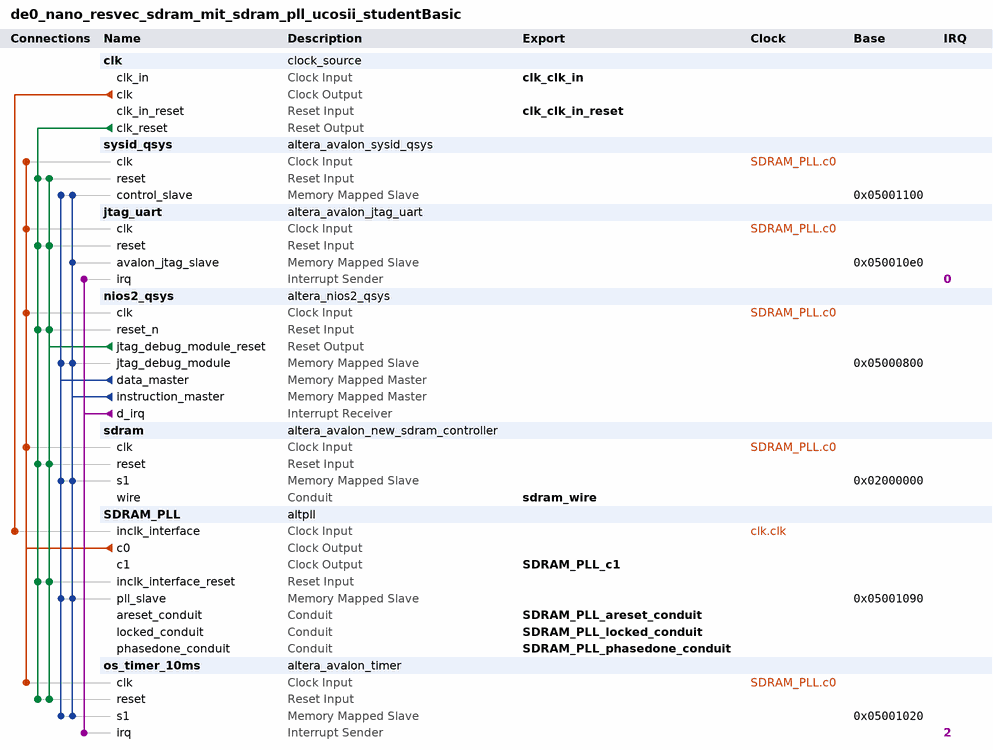
[diagram p0: system contents]
# Platform Designer (Qsys) system de0_nano_resvec_sdram_mit_sdram_pll_ucosii_studentBasic, Cyclone IV GX Unknown
# Parameters at their usual value, and those the tool derives, are not listed.
package require -exact qsys 13.0
create_system de0_nano_resvec_sdram_mit_sdram_pll_ucosii_studentBasic
set_project_property DEVICE_FAMILY {Cyclone IV GX}
set_project_property DEVICE Unknown

add_instance clk clock_source 13.0
set_instance_parameter_value clk clockFrequency 50000000

add_instance sysid_qsys altera_avalon_sysid_qsys 13.0
set_instance_parameter_value sysid_qsys id 20110728

add_instance jtag_uart altera_avalon_jtag_uart 13.0.1.99.2
set_instance_parameter_value jtag_uart simInteractiveOptions INTERACTIVE_ASCII_OUTPUT

add_instance nios2_qsys altera_nios2_qsys 13.0
set_instance_parameter_value nios2_qsys manuallyAssignCpuID false
set_instance_parameter_value nios2_qsys resetSlave sdram.s1
set_instance_parameter_value nios2_qsys exceptionSlave sdram.s1
set_instance_parameter_value nios2_qsys breakSlave nios2_qsys.jtag_debug_module
set_instance_parameter_value nios2_qsys impl Tiny
set_instance_parameter_value nios2_qsys icache_size 4096

add_instance sdram altera_avalon_new_sdram_controller 13.0.1.99.2
set_instance_parameter_value sdram TAC 5.5
set_instance_parameter_value sdram TRCD 20.0
set_instance_parameter_value sdram TRP 20.0
set_instance_parameter_value sdram casLatency 3
set_instance_parameter_value sdram columnWidth 9
set_instance_parameter_value sdram dataWidth 16
set_instance_parameter_value sdram generateSimulationModel false
set_instance_parameter_value sdram model custom
set_instance_parameter_value sdram numberOfBanks 4
set_instance_parameter_value sdram numberOfChipSelects 1
set_instance_parameter_value sdram powerUpDelay 100.0
set_instance_parameter_value sdram refreshPeriod 15.625
set_instance_parameter_value sdram rowWidth 13

add_instance SDRAM_PLL altpll 13.0
set_instance_parameter_value SDRAM_PLL INCLK0_INPUT_FREQUENCY 20000
set_instance_parameter_value SDRAM_PLL CLK0_MULTIPLY_BY 1
set_instance_parameter_value SDRAM_PLL CLK1_MULTIPLY_BY 1
set_instance_parameter_value SDRAM_PLL CLK0_DIVIDE_BY 1
set_instance_parameter_value SDRAM_PLL CLK1_DIVIDE_BY 1
set_instance_parameter_value SDRAM_PLL CLK1_PHASE_SHIFT -1600
set_instance_parameter_value SDRAM_PLL CLK1_DUTY_CYCLE 50
set_instance_parameter_value SDRAM_PLL PORT_clk1 PORT_USED
set_instance_parameter_value SDRAM_PLL PORT_clk2 PORT_UNUSED
set_instance_parameter_value SDRAM_PLL PORT_clk3 PORT_UNUSED
set_instance_parameter_value SDRAM_PLL PORT_ARESET PORT_USED
set_instance_parameter_value SDRAM_PLL PORT_LOCKED PORT_USED

add_instance os_timer_10ms altera_avalon_timer 13.0.1.99.2
set_instance_parameter_value os_timer_10ms period 10
set_instance_parameter_value os_timer_10ms periodUnits MSEC

# connections
add_connection clk.clk SDRAM_PLL.inclk_interface clock
add_connection SDRAM_PLL.c0 jtag_uart.clk clock
add_connection SDRAM_PLL.c0 nios2_qsys.clk clock
add_connection SDRAM_PLL.c0 os_timer_10ms.clk clock
add_connection SDRAM_PLL.c0 sdram.clk clock
add_connection SDRAM_PLL.c0 sysid_qsys.clk clock
add_connection clk.clk_reset jtag_uart.reset reset
add_connection clk.clk_reset nios2_qsys.reset_n reset
add_connection clk.clk_reset os_timer_10ms.reset reset
add_connection clk.clk_reset sdram.reset reset
add_connection clk.clk_reset SDRAM_PLL.inclk_interface_reset reset
add_connection clk.clk_reset sysid_qsys.reset reset
add_connection nios2_qsys.jtag_debug_module_reset jtag_uart.reset reset
add_connection nios2_qsys.jtag_debug_module_reset nios2_qsys.reset_n reset
add_connection nios2_qsys.jtag_debug_module_reset os_timer_10ms.reset reset
add_connection nios2_qsys.jtag_debug_module_reset sdram.reset reset
add_connection nios2_qsys.jtag_debug_module_reset SDRAM_PLL.inclk_interface_reset reset
add_connection nios2_qsys.jtag_debug_module_reset sysid_qsys.reset reset
add_connection nios2_qsys.data_master nios2_qsys.jtag_debug_module avalon
set_connection_parameter_value nios2_qsys.data_master/nios2_qsys.jtag_debug_module baseAddress 0x05000800
add_connection nios2_qsys.data_master os_timer_10ms.s1 avalon
set_connection_parameter_value nios2_qsys.data_master/os_timer_10ms.s1 baseAddress 0x05001020
add_connection nios2_qsys.data_master sdram.s1 avalon
set_connection_parameter_value nios2_qsys.data_master/sdram.s1 baseAddress 0x02000000
add_connection nios2_qsys.data_master SDRAM_PLL.pll_slave avalon
set_connection_parameter_value nios2_qsys.data_master/SDRAM_PLL.pll_slave baseAddress 0x05001090
add_connection nios2_qsys.data_master sysid_qsys.control_slave avalon
set_connection_parameter_value nios2_qsys.data_master/sysid_qsys.control_slave baseAddress 0x05001100
add_connection nios2_qsys.instruction_master jtag_uart.avalon_jtag_slave avalon
set_connection_parameter_value nios2_qsys.instruction_master/jtag_uart.avalon_jtag_slave baseAddress 0x050010e0
add_connection nios2_qsys.instruction_master nios2_qsys.jtag_debug_module avalon
set_connection_parameter_value nios2_qsys.instruction_master/nios2_qsys.jtag_debug_module baseAddress 0x05000800
add_connection nios2_qsys.instruction_master os_timer_10ms.s1 avalon
set_connection_parameter_value nios2_qsys.instruction_master/os_timer_10ms.s1 baseAddress 0x05001020
add_connection nios2_qsys.instruction_master sdram.s1 avalon
set_connection_parameter_value nios2_qsys.instruction_master/sdram.s1 baseAddress 0x02000000
add_connection nios2_qsys.instruction_master SDRAM_PLL.pll_slave avalon
set_connection_parameter_value nios2_qsys.instruction_master/SDRAM_PLL.pll_slave baseAddress 0x05001090
add_connection nios2_qsys.instruction_master sysid_qsys.control_slave avalon
set_connection_parameter_value nios2_qsys.instruction_master/sysid_qsys.control_slave baseAddress 0x05001100
add_connection nios2_qsys.d_irq jtag_uart.irq interrupt
set_connection_parameter_value nios2_qsys.d_irq/jtag_uart.irq irqNumber 0
add_connection nios2_qsys.d_irq os_timer_10ms.irq interrupt
set_connection_parameter_value nios2_qsys.d_irq/os_timer_10ms.irq irqNumber 2

# exported interfaces
add_interface clk_clk_in_reset reset sink
set_interface_property clk_clk_in_reset EXPORT_OF clk.clk_in_reset
add_interface SDRAM_PLL_areset_conduit conduit end
set_interface_property SDRAM_PLL_areset_conduit EXPORT_OF SDRAM_PLL.areset_conduit
add_interface SDRAM_PLL_c1 clock source
set_interface_property SDRAM_PLL_c1 EXPORT_OF SDRAM_PLL.c1
add_interface SDRAM_PLL_phasedone_conduit conduit end
set_interface_property SDRAM_PLL_phasedone_conduit EXPORT_OF SDRAM_PLL.phasedone_conduit
add_interface SDRAM_PLL_locked_conduit conduit end
set_interface_property SDRAM_PLL_locked_conduit EXPORT_OF SDRAM_PLL.locked_conduit
add_interface sdram_wire conduit end
set_interface_property sdram_wire EXPORT_OF sdram.wire
add_interface clk_clk_in clock sink
set_interface_property clk_clk_in EXPORT_OF clk.clk_in

set_interconnect_requirement {$system} qsys_mm.clockCrossingAdapter HANDSHAKE
set_interconnect_requirement {$system} qsys_mm.maxAdditionalLatency 1

save_system de0_nano_resvec_sdram_mit_sdram_pll_ucosii_studentBasic.qsys
